# Altium schematic sheet Synth_Shield.SchDoc: Synth_Audio_KIT
size A4; Author: Giuseppe Pinto; CompanyName: Arduino; DrawnBy: Giuseppe Pinto; Engineer: Giuseppe Pinto; Organization: ARDUINO HW; DocumentNumber: ASX00045; Revision: V 1.0; SheetNumber: 1; SheetTotal: 1; RevAuthor: Giuseppe Pinto
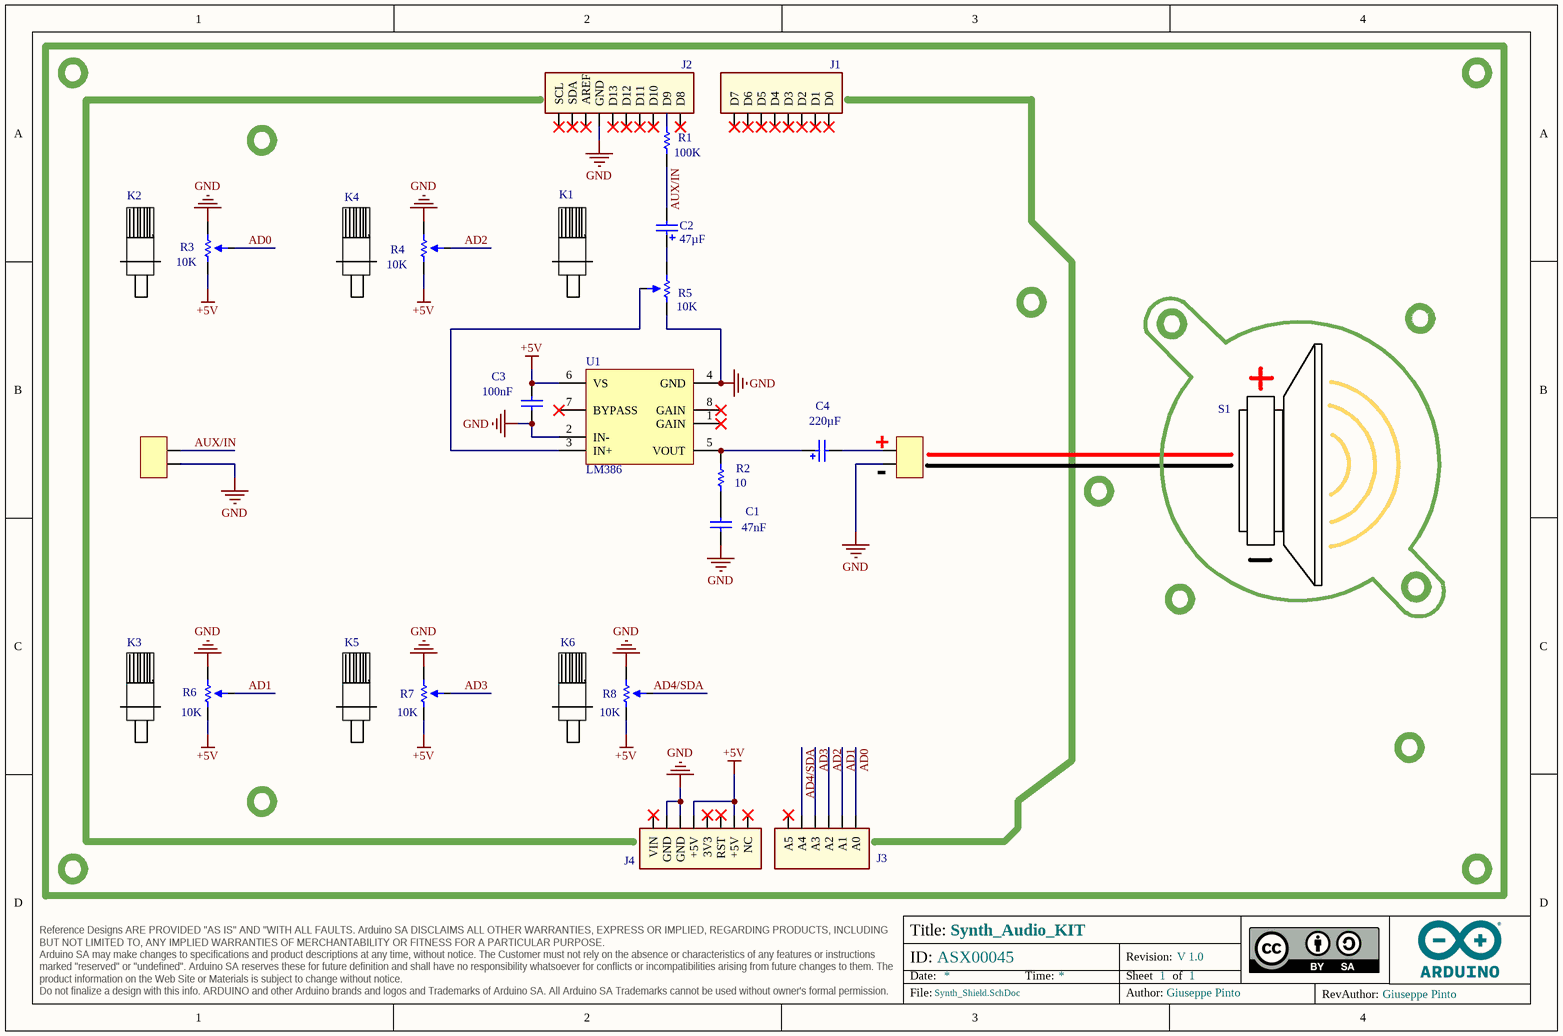
[diagram p0: Synth_Shield.SchDoc]

## Parts
C1  value 47nF  [TS170R1H473KSABB0R]  (hidden comment: TS170R1H473KSABB0R)
C2  value 47µF  [EKF476M1EE05TU]  (hidden comment: EKF476M1EE05TU)
C3  value 100nF  [B32529C0104J289]  (hidden comment: B32529C0104J289)
C4  value 220µF  [EKM227M1EE11TUSAP]  (hidden comment: EKM227M1EE11TUSAP)
J1  PH1-08-UA  [CONN STRIP 2.54 PIN HEADER DIP 180° 1x 8 PIN GOLD FLASH]  (value not drawn)
J2  PH1-10-UA  [CONN STRIP 2.54 PIN HEADER DIP 180° 1x 10 PIN GOLD FLASH]  (value not drawn)
J3  PH1-06-UA  [2.54 PIN HEADER DIP 180° 1x 6 PIN GOLD FLASH]  (value not drawn)
J4  PH1-08-UA  [CONN STRIP 2.54 PIN HEADER DIP 180° 1x 8 PIN GOLD FLASH]  (value not drawn)
J5  MK125002GO  [MK125002GO]  (value not drawn)
J6  MK125002GO  [MK125002GO]  (value not drawn)
K1  KNOB TRIMMER  [0147]  (value not drawn)
K2  KNOB TRIMMER  [0147]  (value not drawn)
K3  KNOB TRIMMER  [0147]  (value not drawn)
K4  KNOB TRIMMER  [0147]  (value not drawn)
K5  KNOB TRIMMER  [0147]  (value not drawn)
K6  KNOB TRIMMER  [0147]  (value not drawn)
R1  value 100K  [-0-1623930-1]  (hidden comment: 1623930-1)
R2  value 10  [R0230]  (hidden comment: 1623930-5)
R3  Value max: 10K  [New footprint 1]  (hidden comment: CA9MV10-10KA2020)
R4  Value max: 10K  [New footprint 1]  (hidden comment: CA9MV10-10KA2020)
R5  Value max: 10K  [New footprint 1]  (hidden comment: CA9MV10-10KA2020)
R6  Value max: 10K  [New footprint 1]  (hidden comment: CA9MV10-10KA2020)
R7  Value max: 10K  [New footprint 1]  (hidden comment: CA9MV10-10KA2020)
R8  Value max: 10K  [New footprint 1]  (hidden comment: CA9MV10-10KA2020)
S1  L50EJ050008WLFLM-002  [L50EJ050008WLFLM-002]  (value not drawn)
U1  LM386  [P0008A]

## Nets
+5V: C3.1 J4.2(+5V) J4.5(+5V) R3.3 R4.3 R6.3 R7.3 R8.3 U1.6(VS)
GND: C1.2 C3.2 J2.7(GND) J4.6(GND) J4.7(GND) J5.1 J6.1 R3.1 R4.1 R5.1 R6.1 R7.1 R8.1 U1.2(IN-) U1.4(GND)
AD0: J3.1(A0) R3.2
AD1: J3.2(A1) R6.2
AD2: J3.3(A2) R4.2
AD3: J3.4(A3) R7.2
AD4/SDA: J3.5(A4) R8.2
AUX/IN: C2.1 J6.2 R1.2
NetC1_1: C1.1 R2.2
NetC2_2: C2.2 R5.3
NetC4_1: C4.1 J5.2
NetC4_2: C4.2 R2.1 U1.5(VOUT)
NetJ2_2: J2.2(D9) R1.1
NetR5_2: R5.2 U1.3(IN+)

Not connected (* = marked no-connect by the designer): J1 1(D0)* 2(D1)* 3(D2)* 4(D3)* 5(D4)* 6(D5)* 7(D6)* 8(D7)*; J2 1(D8)* 3(D10)* 4(D11)* 5(D12)* 6(D13)* 8(AREF)* 9(SDA)* 10(SCL)*; J3 6(A5)*; J4 1(NC)* 3(RST)* 4(3V3)* 8(VIN)*; U1 1(GAIN)* 7(BYPASS)* 8(GAIN)*

## Notes on the sheet
- (near J5) +
- (near J5) -
- Title:
- ID:
- Date:
- Time:
- Revision:
- Sheet
- of
- RevAuthor:
- Reference Designs ARE PROVIDED "AS IS" AND "WITH ALL FAULTS. Arduino SA DISCLAIMS ALL OTHER WARRANTIES, EXPRESS OR IMPLIED, REGARDING PRODUCTS, INCLUDING BUT NOT LIMITED TO, ANY IMPLIED WARRANTIES OF MERCHANTABILITY OR FITNESS FOR A PARTICULAR PURPOSE.
  Arduino SA may make changes to specifications and product descriptions at any time, without notice. The Customer must not rely on the absence or characteristics of any features or instructions marked "reserved" or "undefined". Arduino SA reserves these for future definition and shall have no responsibility whatsoever for conflicts or incompatibilities arising from future changes to them. The product information on the Web Site or Materials is subject to change without notice.
  Do not finalize a design with this info. ARDUINO and other Arduino brands and logos and Trademarks of Arduino SA. All Arduino SA Trademarks cannot be used without owner's formal permission.
- File:
- Author:

## Library data of the parts
C1 = C0131-A.2: CAP THD 47nF 50V C0G 5%; Manufacturer: Suntan; Code Arduino: C0131; Part Number: TS170R1H473KSABB0R; Package: P : 5.08 Ammo; Voltage: 50V; Tolerance: 5%
C2 = C0125-A.8: CAP ALUM POL THD 47uF 25V; Manufacturer: SAMXON; Tolerance: 20%; Code Arduino: C0125; Manufacturer Part Number 2: EKF476M1EE05TU; Package: 6.3x5mm  P. 2.5mm; Voltage: 25V; Part Number: EKF476M1EE05TU
C3 = C0127-A.6: CAP THD 100NF 63V POLIESTER; Manufacturer: EPCOS; Code Arduino: 0080; Tolerance: 5%; Part Number: B32529C0104J289; Voltage: 63V
C4 = C0129-A.1: CAP ALUM POL THD 220uF 25V; Manufacturer: Man Yue Electronics Co.,Ltd; Tolerance: 20%; Code Arduino: C0129; Manufacturer Part Number 2: EKM227M1EE11TUSAP; Package: 6.3x11mm  P. 2.5mm; Voltage: 25V; Part Number: EKM227M1EE11TUSAP
J1 = J0308-A.2: CONN STRIP 2.54 PIN HEADER DIP 180° 1x 8 PIN GOLD FLASH; Manufacturer: 4UCONN; Number of Contacts: 8; Code Arduino: J0308; Number of Rows: 1; Part Number: PH1-08-UA; Number of Ports: 8; Number of Conductors: 8
J2 = J0307-A.3: CONN STRIP 2.54 PIN HEADER DIP 180° 1x 10 PIN GOLD FLASH; Manufacturer: 4UCONN; Code Arduino: J0307; Number of Ports: 10; Part Number: PH1-10-UA; Number of Conductors: 10; Number of Contacts: 10; Number of Rows: 1
J3 = J0305-A.3: CONN STRIP 2.54 PIN HEADER DIP 180° 1x 6 PIN GOLD FLASH; Manufacturer: 4UCONN; Number of Conductors: 6; Code Arduino: J0305; Part Number: PH1-06-UA; Number of Ports: 6; Number of Rows: 1; Number of Contacts: 6
J4 = J0306-A.2: CONN STRIP 2.54 PIN HEADER DIP 180° 1x 8 PIN GOLD FLASH; Manufacturer: 4UCONN; Number of Contacts: 8; Code Arduino: J0306; Number of Rows: 1; Part Number: PH1-08-UA; Number of Conductors: 8; Number of Ports: 8
J5 J6 = J0012-A.7: CONN MORS.CS 2v p3,5 10A aLING.VER; Manufacturer: Adimpex; Code Arduino: 2341; Manufacturer 2: 4U CON; Manufacturer Part Number 2: 19TW-974; Part Number: MK125002GO
K1-K6 = 0147-A.4: KNOB TRIMMER ALBERINO.CA9 L23 D6/9mm; Part Number: 9006; Manufacturer: T2; Code Arduino: 0147
R1 = R0231-A.3: RES FIXED THD 1/4W 5% 100K; Manufacturer: TE connectivity; Code Arduino: R0231; Power: 330mW; Tolerance: 5%; Part Number: 1623930-1
R2 = R0230-A.2: RES FIXED THD 1/4W 5% 10R; Manufacturer: TE connectivity; Power: 330mW; Tolerance: 5%; Code Arduino: R0230; Part Number: 1623930-5
R3-R8 = 0086-2: Potentiometer 10kilohm - TRIMMER; Code Arduino: 0086; Value min: 0; Part Number: CA9MV10-10KA2020; Manufacturer: CA9MV10-10KA2020
S1 = S0025-A.7: Paper Speaker 8Ω 1W + Grid  PCB; Manufacturer: DB Pructs Limited; Code Arduino: A5205; Part Number: L50EJ050008WLFLM-002
U1 = U0251-A.1: Audio Amplifier, 0.325W, 1 Channel(s), 1 Func, Bipolar, PDIP8; Part Number: LM386N-1/NOPB; Code Arduino: U0251; Number of Pins: 8; Min Operating Temperature: 0°C; Max Operating Temperature: 70°C